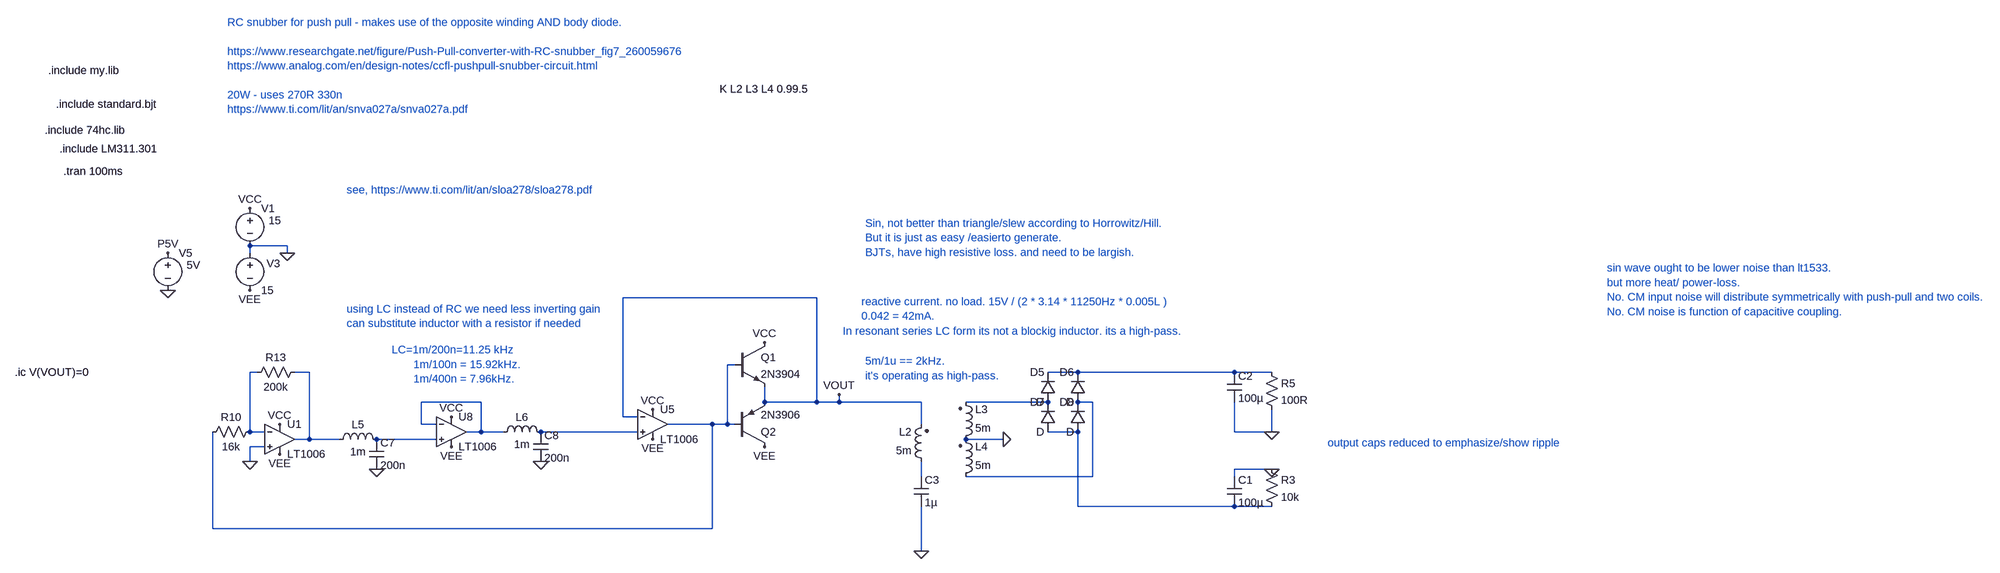
[diagram p0: schematic Draft11.asc]
Draft11.asc, the LTspice schematic file:
Version 4
SHEET 1 5720 1740
WIRE 192 -160 112 -160
WIRE 112 -144 112 -160
WIRE 192 -144 192 -160
WIRE 1328 -48 912 -48
WIRE 1152 96 1136 96
WIRE 128 112 112 112
WIRE 240 112 208 112
WIRE 1888 112 1824 112
WIRE 2224 112 1888 112
WIRE 2304 112 2224 112
WIRE 608 176 480 176
WIRE 1216 176 1216 144
WIRE 1328 176 1328 -48
WIRE 1328 176 1216 176
WIRE 1376 176 1376 160
WIRE 1376 176 1328 176
WIRE 1552 176 1376 176
WIRE 1824 176 1648 176
WIRE 1920 176 1888 176
WIRE 912 208 912 -48
WIRE 944 208 912 208
WIRE 480 224 480 176
WIRE 512 224 480 224
WIRE 1104 224 1008 224
WIRE 1136 224 1136 96
WIRE 1136 224 1104 224
WIRE 1152 224 1136 224
WIRE 1552 224 1552 176
WIRE 112 240 112 112
WIRE 144 240 112 240
WIRE 608 240 608 176
WIRE 608 240 576 240
WIRE 656 240 608 240
WIRE 944 240 736 240
WIRE 1888 240 1824 240
WIRE 2224 240 2224 176
WIRE 2304 240 2304 192
WIRE 2304 240 2224 240
WIRE 240 256 240 112
WIRE 240 256 208 256
WIRE 304 256 240 256
WIRE 512 256 384 256
WIRE 1728 256 1648 256
WIRE 144 272 112 272
WIRE 112 304 112 272
WIRE 2304 320 2224 320
WIRE 1552 336 1552 304
WIRE 1920 336 1920 176
WIRE 1920 336 1648 336
WIRE 2224 336 2224 320
WIRE 1888 400 1888 240
WIRE 2224 400 1888 400
WIRE 2304 400 2224 400
WIRE 32 448 32 240
WIRE 1104 448 1104 224
WIRE 1104 448 32 448
WIRE 1552 496 1552 400
FLAG 2304 240 0
FLAG 1728 256 0
FLAG 2304 320 0
FLAG 192 -144 0
FLAG 112 -240 VCC
FLAG 112 -64 VEE
FLAG -64 -144 P5V
FLAG -64 -64 0
FLAG 112 304 0
FLAG 176 224 VCC
FLAG 176 288 VEE
FLAG 384 320 0
FLAG 976 192 VCC
FLAG 976 256 VEE
FLAG 1376 160 VOUT
FLAG 544 208 VCC
FLAG 544 272 VEE
FLAG 736 304 0
FLAG 1216 48 VCC
FLAG 1216 272 VEE
FLAG 1552 496 0
SYMBOL ind2 1632 272 M180
WINDOW 0 36 80 Left 2
WINDOW 3 36 40 Left 2
SYMATTR InstName L3
SYMATTR Value 5m
SYMATTR Type ind
SYMBOL ind2 1568 320 R180
WINDOW 0 36 80 Left 2
WINDOW 3 36 40 Left 2
SYMATTR InstName L2
SYMATTR Value 5m
SYMATTR Type ind
SYMBOL diode 1840 176 R180
WINDOW 0 24 64 Left 2
WINDOW 3 24 0 Left 2
SYMATTR InstName D5
SYMBOL diode 1904 176 R180
WINDOW 0 24 64 Left 2
WINDOW 3 24 0 Left 2
SYMATTR InstName D6
SYMBOL diode 1840 240 R180
WINDOW 0 24 64 Left 2
WINDOW 3 24 0 Left 2
SYMATTR InstName D7
SYMBOL diode 1904 240 R180
WINDOW 0 24 64 Left 2
WINDOW 3 24 0 Left 2
SYMATTR InstName D8
SYMBOL cap 2208 112 R0
SYMATTR InstName C2
SYMATTR Value 100µ
SYMBOL res 2288 96 R0
SYMATTR InstName R5
SYMATTR Value 100R
SYMBOL ind2 1632 352 M180
WINDOW 0 36 80 Left 2
WINDOW 3 36 40 Left 2
SYMATTR InstName L4
SYMATTR Value 5m
SYMATTR Type ind
SYMBOL cap 2208 336 R0
SYMATTR InstName C1
SYMATTR Value 100µ
SYMBOL res 2288 304 R0
SYMATTR InstName R3
SYMATTR Value 10k
SYMBOL voltage 112 -256 R0
WINDOW 123 0 0 Left 0
WINDOW 39 0 0 Left 0
WINDOW 3 40 42 Left 2
SYMATTR Value 15
SYMATTR InstName V1
SYMBOL voltage 112 -160 R0
WINDOW 123 0 0 Left 0
WINDOW 39 0 0 Left 0
WINDOW 0 36 39 Left 2
SYMATTR InstName V3
SYMATTR Value 15
SYMBOL voltage -64 -160 R0
WINDOW 123 0 0 Left 0
WINDOW 39 0 0 Left 0
WINDOW 3 40 42 Left 2
SYMATTR Value 5V
SYMATTR InstName V5
SYMBOL OpAmps\\LT1006 176 192 R0
SYMATTR InstName U1
SYMBOL res 128 224 R90
WINDOW 0 0 56 VBottom 2
WINDOW 3 32 56 VTop 2
SYMATTR InstName R10
SYMATTR Value 16k
SYMBOL res 224 96 R90
WINDOW 0 0 56 VBottom 2
WINDOW 3 32 56 VTop 2
SYMATTR InstName R13
SYMATTR Value 200k
SYMBOL cap 368 256 R0
SYMATTR InstName C7
SYMATTR Value 200n
SYMBOL OpAmps\\LT1006 976 160 R0
SYMATTR InstName U5
SYMBOL OpAmps\\LT1006 544 176 R0
SYMATTR InstName U8
SYMBOL cap 720 240 R0
SYMATTR InstName C8
SYMATTR Value 200n
SYMBOL npn 1152 48 R0
SYMATTR InstName Q1
SYMATTR Value 2N3904
SYMBOL pnp 1152 272 M180
SYMATTR InstName Q2
SYMATTR Value 2N3906
SYMBOL ind 288 272 R270
WINDOW 0 32 56 VTop 2
WINDOW 3 5 56 VBottom 2
SYMATTR InstName L5
SYMATTR Value 1m
SYMBOL ind 640 256 R270
WINDOW 0 32 56 VTop 2
WINDOW 3 5 56 VBottom 2
SYMATTR InstName L6
SYMATTR Value 1m
SYMBOL cap 1536 336 R0
SYMATTR InstName C3
SYMATTR Value 1µ
TEXT -288 -320 Left 2 !.tran 100ms
TEXT -328 -408 Left 2 !.include 74hc.lib
TEXT 1120 -496 Left 2 !K L2 L3 L4 0.99.5
TEXT -304 -464 Left 2 !.include standard.bjt
TEXT -296 -368 Left 2 !.include LM311.301
TEXT -320 -536 Left 2 !.include my.lib
TEXT 2424 264 Left 2 ;output caps reduced to emphasize/show ripple
TEXT 64 -640 Left 2 ;RC snubber for push pull - makes use of the opposite winding AND body diode.\n \nhttps://www.researchgate.net/figure/Push-Pull-converter-with-RC-snubber_fig7_260059676\nhttps://www.analog.com/en/design-notes/ccfl-pushpull-snubber-circuit.html\n \n20W - uses 270R 330n\nhttps://www.ti.com/lit/an/snva027a/snva027a.pdf
TEXT -392 112 Left 2 !.ic V(VOUT)=0
TEXT 320 -280 Left 2 ;see, https://www.ti.com/lit/an/sloa278/sloa278.pdf
TEXT 320 -24 Left 2 ;using LC instead of RC we need less inverting gain\ncan substitute inductor with a resistor if needed
TEXT 3840 -112 Left 2 ;sin wave ought to be lower noise than lt1533.\nbut more heat/ power-loss.\nNo. CM input noise will distribute symmetrically with push-pull and two coils.\nNo. CM noise is function of capacitive coupling.
TEXT 416 64 Left 2 ;LC=1m/200n=11.25 kHz\n       1m/100n = 15.92kHz.\n       1m/400n = 7.96kHz.
TEXT 1424 -40 Left 2 ;reactive current. no load. 15V / (2 * 3.14 * 11250Hz * 0.005L )\n0.042 = 42mA.
TEXT 1432 -208 Left 2 ;Sin, not better than triangle/slew according to Horrowitz/Hill.\nBut it is just as easy /easierto generate.\nBJTs, have high resistive loss. and need to be largish.
TEXT 1432 88 Left 2 ;5m/1u == 2kHz.\nit's operating as high-pass.
TEXT 1384 24 Left 2 ;In resonant series LC form its not a blockig inductor. its a high-pass.

The netlist it stands for:
* Draft11.asc
L3 0 N006 5m
L2 N011 VOUT 5m
D5 N006 N004 D
D6 N007 N004 D
D7 N009 N006 D
D8 N009 N007 D
C2 N004 0 100µ
R5 N004 0 100R
L4 N007 0 5m
C1 0 N009 100µ
R3 0 N009 10k
V1 VCC 0 15
V3 0 VEE 15
V5 P5V 0 5V
XU1 0 N002 VCC VEE N003 LT1006  ; pins In+ In- V+ V- OUT
R10 N002 N001 16k
R13 N003 N002 200k
C7 N010 0 200n
XU5 N008 VOUT VCC VEE N001 LT1006  ; pins In+ In- V+ V- OUT
XU8 N010 N005 VCC VEE N005 LT1006  ; pins In+ In- V+ V- OUT
C8 N008 0 200n
Q1 VCC N001 VOUT 0 2N3904
Q2 VEE N001 VOUT 0 2N3906
L5 N003 N010 1m
L6 N005 N008 1m
C3 N011 0 1µ
.model D D
.lib standard.dio
.model NPN NPN
.model PNP PNP
.lib standard.bjt
.tran 100ms
.include 74hc.lib
K L2 L3 L4 0.99.5
.include standard.bjt
.include LM311.301
.include my.lib
* output caps reduced to emphasize/show ripple
* RC snubber for push pull - makes use of the opposite winding AND body diode.
* https://www.researchgate.net/figure/Push-Pull-converter-with-RC-snubber_fig7_260059676
* https://www.analog.com/en/design-notes/ccfl-pushpull-snubber-circuit.html
* 20W - uses 270R 330n
* https://www.ti.com/lit/an/snva027a/snva027a.pdf
.ic V(VOUT)=0
* see, https://www.ti.com/lit/an/sloa278/sloa278.pdf
* using LC instead of RC we need less inverting gain
* can substitute inductor with a resistor if needed
* sin wave ought to be lower noise than lt1533.
* but more heat/ power-loss.
* No. CM input noise will distribute symmetrically with push-pull and two coils.
* No. CM noise is function of capacitive coupling.
* LC=1m/200n=11.25 kHz
*        1m/100n = 15.92kHz.
*        1m/400n = 7.96kHz.
* reactive current. no load. 15V / (2 * 3.14 * 11250Hz * 0.005L )
* 0.042 = 42mA.
* Sin, not better than triangle/slew according to Horrowitz/Hill.
* But it is just as easy /easierto generate.
* BJTs, have high resistive loss. and need to be largish.
* 5m/1u == 2kHz.
* it's operating as high-pass.
* In resonant series LC form its not a blockig inductor. its a high-pass.
.lib LTC.lib
.backanno
.end